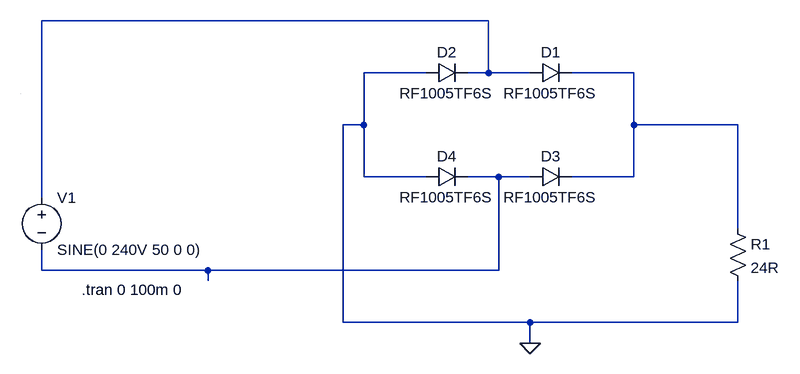
[diagram p0: schematic Draft1.asc]
Draft1.asc, the LTspice schematic file:
Version 4
SHEET 1 1172 680
WIRE 720 -112 32 -112
WIRE 624 -32 528 -32
WIRE 720 -32 720 -112
WIRE 720 -32 688 -32
WIRE 784 -32 720 -32
WIRE 944 -32 848 -32
WIRE 528 48 528 -32
WIRE 528 48 496 48
WIRE 944 48 944 -32
WIRE 1104 48 944 48
WIRE 528 128 528 48
WIRE 624 128 528 128
WIRE 736 128 688 128
WIRE 784 128 736 128
WIRE 944 128 944 48
WIRE 944 128 848 128
WIRE 32 160 32 -112
WIRE 1104 208 1104 48
WIRE 32 272 32 240
WIRE 288 272 32 272
WIRE 736 272 736 128
WIRE 736 272 288 272
WIRE 288 288 288 272
WIRE 496 352 496 48
WIRE 784 352 496 352
WIRE 1104 352 1104 288
WIRE 1104 352 784 352
WIRE 784 384 784 352
WIRE 0 0 0 0
FLAG 784 384 0
SYMBOL voltage 32 144 R0
WINDOW 123 0 0 Left 0
WINDOW 39 0 0 Left 0
SYMATTR InstName V1
SYMATTR Value SINE(0 240V 50 0 0)
SYMBOL diode 784 -16 R270
WINDOW 0 32 32 VTop 2
WINDOW 3 0 32 VBottom 2
SYMATTR InstName D1
SYMATTR Value RF1005TF6S
SYMBOL res 1088 192 R0
SYMATTR InstName R1
SYMATTR Value 24R
SYMBOL diode 624 -16 R270
WINDOW 0 32 32 VTop 2
WINDOW 3 0 32 VBottom 2
SYMATTR InstName D2
SYMATTR Value RF1005TF6S
SYMBOL diode 784 144 R270
WINDOW 0 32 32 VTop 2
WINDOW 3 0 32 VBottom 2
SYMATTR InstName D3
SYMATTR Value RF1005TF6S
SYMBOL diode 624 144 R270
WINDOW 0 32 32 VTop 2
WINDOW 3 0 32 VBottom 2
SYMATTR InstName D4
SYMATTR Value RF1005TF6S
TEXT 94 302 Left 2 !.tran 0 100m 0

The netlist it stands for:
* Draft1.asc
V1 N001 N003 SINE(0 240V 50 0 0)
D1 N001 N002 RF1005TF6S
R1 N002 0 24R
D2 0 N001 RF1005TF6S
D3 N003 N002 RF1005TF6S
D4 0 N003 RF1005TF6S
.model D D
.lib standard.dio
.tran 0 100m 0
.backanno
.end